# Altium project PCB_Project.PrjPcb
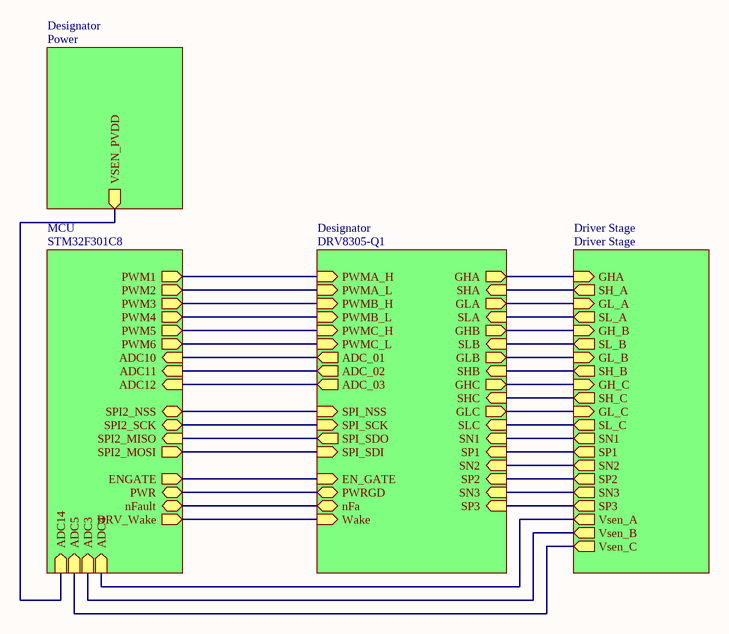
[diagram p0: Top.SchDoc]
5 sheets, 72 parts. Net scope: hierarchical (ports join the sheet entries above them; power ports are global).
Board files: 2layer.PcbDoc, 4_layer.PcbDoc
Sheets:
  Top.SchDoc
    MCU = STM32F301C8.SchDoc
    Designator = DRV8305-Q1.SchDoc
    Designator = Power.SchDoc
    Driver Stage = Driver Stage.SchDoc

## Sheet Top.SchDoc
size A4

### Sub-sheets
Designator = DRV8305-Q1: SPI_SCK (in), SPI_SDI (in), SPI_SDO (out), SPI_NSS (in), PWMA_H (in), PWMA_L (in), PWMB_H (in), PWMB_L (in), PWMC_H (in), PWMC_L (in), ADC_01 (out), ADC_02 (out), ADC_03 (out), nFa, EN_GATE (in), GHA (out), SHA (in), GLA (out), SLA (in), GHB (out), SLB (in), GLB (out), SHB (in), GHC (out), SHC (in), GLC (out), SLC (in), PWRGD (bidir), Wake (in), SN1 (in), SP1 (in), SN2 (in), SP2 (in), SN3 (in), SP3 (in)
Designator = Power: VSEN_PVDD (out)
Driver Stage = Driver Stage: GH_B (in), SH_B (out), GL_B (in), SL_B (out), GHA (in), SH_A (out), GL_A (in), SL_A (out), SL_C (out), GL_C (in), SH_C (out), GH_C (in), Vsen_C (out), Vsen_B (out), Vsen_A (out), SN1 (out), SP1 (out), SN2 (out), SP2 (out), SN3 (out), SP3 (out)
MCU = STM32F301C8: PWM1 (out), PWM2 (out), PWM3 (out), PWM4 (out), PWM5 (out), PWM6 (out), ADC10 (in), ADC11 (in), ADC12 (in), SPI2_NSS (bidir), SPI2_SCK (bidir), ADC4 (in), ADC3 (in), ADC5 (in), ADC14 (in), nFault (bidir), ENGATE (out), SPI2_MISO (in), SPI2_MOSI (out), PWR, DRV_Wake (out)

### Nets
MOT_A: sheet Designator/SHA, sheet Driver Stage/SH_A
MOT_B: sheet Designator/SHB, sheet Driver Stage/SH_B
MOT_C: sheet Designator/SHC, sheet Driver Stage/SH_C
VSEN_PVDD: sheet MCU/ADC14, sheet Designator/VSEN_PVDD
NetC30_1: sheet MCU/ADC4, sheet Driver Stage/Vsen_A
NetC31_1: sheet MCU/ADC3, sheet Driver Stage/Vsen_B
NetC32_1: sheet MCU/ADC5, sheet Driver Stage/Vsen_C
NetC33_1: sheet Designator/SN1, sheet Driver Stage/SN1
NetC33_2: sheet Designator/SP1, sheet Driver Stage/SP1
NetC34_1: sheet Designator/SN3, sheet Driver Stage/SN3
NetC34_2: sheet Designator/SP3, sheet Driver Stage/SP3
NetC35_1: sheet Designator/SN2, sheet Driver Stage/SN2
NetC35_2: sheet Designator/SP2, sheet Driver Stage/SP2
NetIC1_5: sheet MCU/SPI2_NSS, sheet Designator/SPI_NSS
NetIC1_6: sheet MCU/SPI2_SCK, sheet Designator/SPI_SCK
NetIC1_10: sheet MCU/PWM1, sheet Designator/PWMA_H
NetIC1_11: sheet MCU/PWM2, sheet Designator/PWMA_L
NetIC1_15: sheet MCU/ENGATE, sheet Designator/EN_GATE
NetIC1_16: sheet MCU/ADC10, sheet Designator/ADC_01
NetIC1_17: sheet MCU/nFault, sheet Designator/nFa
NetIC1_18: sheet MCU/ADC11, sheet Designator/ADC_02
NetIC1_19: sheet MCU/ADC12, sheet Designator/ADC_03
NetIC1_20: sheet MCU/PWR, sheet Designator/PWRGD
NetIC1_21: sheet MCU/PWM3, sheet Designator/PWMB_H
NetIC1_26: sheet MCU/DRV_Wake, sheet Designator/Wake
NetIC1_27: sheet MCU/SPI2_MISO, sheet Designator/SPI_SDO
NetIC1_28: sheet MCU/SPI2_MOSI, sheet Designator/SPI_SDI
NetIC1_29: sheet MCU/PWM5, sheet Designator/PWMC_H
NetIC1_30: sheet MCU/PWM6, sheet Designator/PWMC_L
NetIC1_31: sheet MCU/PWM4, sheet Designator/PWMB_L
NetNT1_2: sheet Designator/SLA, sheet Driver Stage/SL_A
NetNT2_2: sheet Designator/SLB, sheet Driver Stage/SL_B
NetNT3_2: sheet Designator/SLC, sheet Driver Stage/SL_C
NetQ2_4: sheet Designator/GHB, sheet Driver Stage/GH_B
NetQ3_4: sheet Designator/GHC, sheet Driver Stage/GH_C
NetQ4_4: sheet Designator/GLA, sheet Driver Stage/GL_A
NetQ5_4: sheet Designator/GLB, sheet Driver Stage/GL_B
NetQ6_4: sheet Designator/GLC, sheet Driver Stage/GL_C
NetU1_36: sheet Designator/GHA, sheet Driver Stage/GHA

## Sheet STM32F301C8.SchDoc: STM32F301C7
size A4; Revision: 1.0
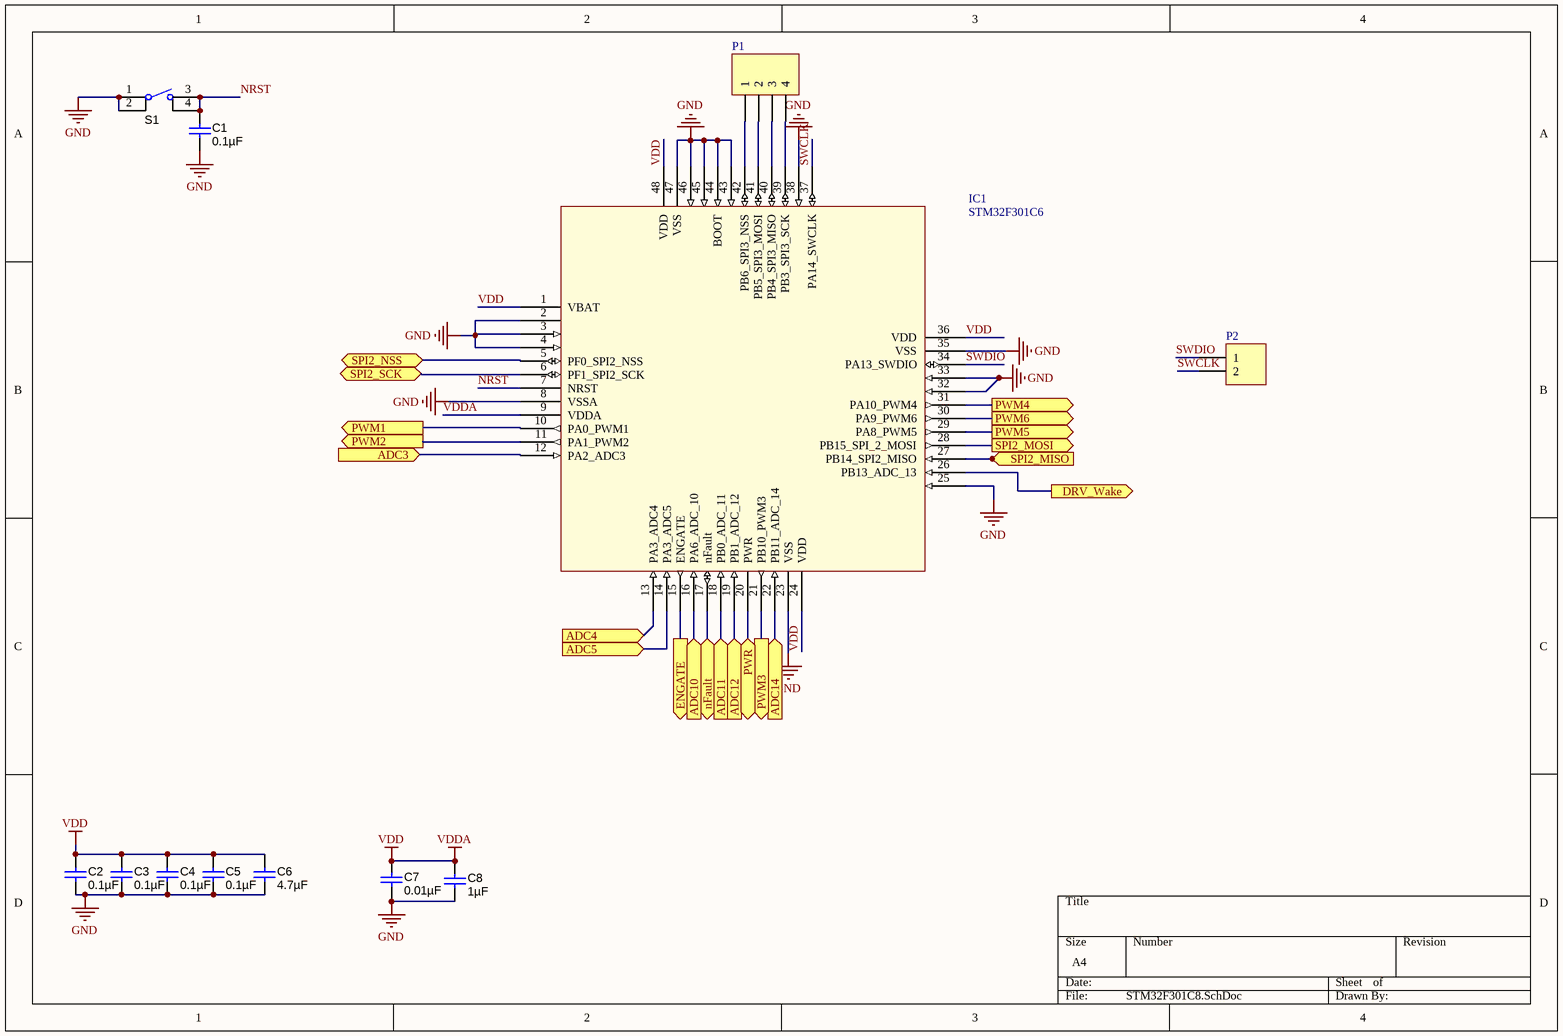
[diagram p1: STM32F301C8.SchDoc]

### Parts
C1  ValueDisplayed: 0.1µF  [0603L]  (hidden comment: C1608X7R1H104K)
C2  ValueDisplayed: 0.1µF  [0603L]  (hidden comment: C1608X7R1H104K)
C3  ValueDisplayed: 0.1µF  [0603L]  (hidden comment: C1608X7R1H104K)
C4  ValueDisplayed: 0.1µF  [0603L]  (hidden comment: C1608X7R1H104K)
C5  ValueDisplayed: 0.1µF  [0603L]  (hidden comment: C1608X7R1H104K)
C6  ValueDisplayed: 4.7µF  [0805L]  (hidden comment: GRM21BR71A475KA73L)
C7  ValueDisplayed: 0.01µF  [0603L]  (hidden comment: C1608X8R1H103K)
C8  ValueDisplayed: 1µF  [0603L]  (hidden comment: C1608X7R1C105K)
IC1  STM32F301C6  [LQFP48-7x7mm]
P1  (no value)  [HDR1X4]
P2  (no value)  [HDR1X2]
S1  4-1437565-1  [SW_FSM4JSMA]  (value not drawn)

### Ports
ADC3 (in), ADC4 (in), ADC5 (in), ADC10 (in), ADC11 (in), ADC12 (in), ADC14 (in), DRV_Wake (out), ENGATE (out), nFault (bidir), PWM1 (out), PWM2 (out), PWM3 (out), PWM4 (out), PWM5 (out), PWM6 (out), PWR, SPI2_MISO (in), SPI2_MOSI (out), SPI2_NSS (bidir), SPI2_SCK (bidir)

### Nets
GND: C1.2 C2.2 C3.2 C4.2 C5.2 C6.2 C7.2 C8.2 IC1.2 IC1.3 IC1.4 IC1.8(VSSA) IC1.23(VSS) IC1.25 IC1.32 IC1.33 IC1.35(VSS) IC1.38 IC1.43 IC1.44(BOOT) IC1.45 IC1.46 IC1.47(VSS) S1.1 S1.2
VDD: C2.1 C3.1 C4.1 C5.1 C6.1 C7.1 C8.1 IC1.1(VBAT) IC1.9(VDDA) IC1.24(VDD) IC1.36(VDD) IC1.48(VDD)  [also labelled VDDA]
NRST: C1.1 IC1.7(NRST) S1.3 S1.4
SWCLK: IC1.37(PA14_SWCLK) P2.2
SWDIO: IC1.34(PA13_SWDIO) P2.1
VSEN_PVDD: IC1.22(PB11_ADC_14) ; port ADC14
NetC30_1: IC1.13(PA3_ADC4) ; port ADC4
NetC31_1: IC1.12(PA2_ADC3) ; port ADC3
NetC32_1: IC1.14(PA3_ADC5) ; port ADC5
NetIC1_5: IC1.5(PF0_SPI2_NSS) ; port SPI2_NSS
NetIC1_6: IC1.6(PF1_SPI2_SCK) ; port SPI2_SCK
NetIC1_10: IC1.10(PA0_PWM1) ; port PWM1
NetIC1_11: IC1.11(PA1_PWM2) ; port PWM2
NetIC1_15: IC1.15(ENGATE) ; port ENGATE
NetIC1_16: IC1.16(PA6_ADC_10) ; port ADC10
NetIC1_17: IC1.17(nFault) ; port nFault
NetIC1_18: IC1.18(PB0_ADC_11) ; port ADC11
NetIC1_19: IC1.19(PB1_ADC_12) ; port ADC12
NetIC1_20: IC1.20(PWR) ; port PWR
NetIC1_21: IC1.21(PB10_PWM3) ; port PWM3
NetIC1_26: IC1.26(PB13_ADC_13) ; port DRV_Wake
NetIC1_27: IC1.27(PB14_SPI2_MISO) ; port SPI2_MISO
NetIC1_28: IC1.28(PB15_SPI_2_MOSI) ; port SPI2_MOSI
NetIC1_29: IC1.29(PA8_PWM5) ; port PWM5
NetIC1_30: IC1.30(PA9_PWM6) ; port PWM6
NetIC1_31: IC1.31(PA10_PWM4) ; port PWM4
NetIC1_39: IC1.39(PB3_SPI3_SCK) P1.4
NetIC1_40: IC1.40(PB4_SPI3_MISO) P1.3
NetIC1_41: IC1.41(PB5_SPI3_MOSI) P1.2
NetIC1_42: IC1.42(PB6_SPI3_NSS) P1.1

### Library data of the parts
C1-C5 = C1608X7R1H104K: CAP, CERM, 0.1 µF, 50 V, +/- 10%, X7R, 0603; Manufacturer: TDK; Polarized: N; CompType: Capacitor; Value: 0.1uF; U/M: EA; Cap_F: 0.0000001; Tolerance_%: 10; ESR_ohm: 0.017; Value1: 0.017 ohm; VDC_V: 50; Value2: 50V; TaMin_C: -55; TaMax_C: 125; Cap_Case: 0603; AEC Category: Q200; SymbolVersion: 2008-07-09; PartNumber: C1608X7R1H104K; PackageReference: 0603; RoHS: Y; MountType: SMT; Technology: Ceramic; TempCo: X7R; Published: 2008-06-19; Publisher: Texas Instruments; LatestRevisionDate: 2015-12-04; ComponentLink1Description: Datasheet link; ComponentLink1URL: http://www.tdk.co.jp/tefe02/e412_c.pdf; Supplier 1: Digi-Key; Supplier Part Number 1: 445-1314-1-ND; Supplier 2: Farnell; Supplier Part Number 2: 1118182; AEC Qualified: ?
C6 = GRM21BR71A475KA73L: CAP, CERM, 4.7 µF, 10 V, +/- 10%, X7R, 0805; Manufacturer: MuRata; Polarized: N; CompType: Capacitor; Value: 4.7uF; U/M: EA; Cap_F: 0.0000047; Tolerance_%: 10; Value1: Unknown; Value2: 10V; TaMin_C: -55; TaMax_C: 125; Cap_Case: 0805; AEC Category: Q200; SymbolVersion: 2008-07-09; PartNumber: GRM21BR71A475KA73L; PackageReference: 0805; RoHS: Y; VDC_V: 10; MountType: SMT; Technology: Ceramic; TempCo: X7R; Published: 2008-06-19; Publisher: Texas Instruments; LatestRevisionDate: 2015-12-04; ComponentLink1Description: Datasheet link; ComponentLink1URL: http://search.murata.co.jp/Ceramy/PnsearchViewAction.do?HnOFG=ON&HnNFG=ON&SEL_CNT=50&sLang=en&sKey=GRM21BR71A475KA73L&x=9&y=9&search=startwith; Supplier 1: Digi-Key; Supplier Part Number 1: GRM21BR71A475KA73L-ND; Supplier 2: Mouser; Supplier Part Number 2: 81-GRM21BR71A475KA73; Supplier 3: Farnell; Supplier Part Number 3: 1845769; AEC Qualified: ?
C7 = C1608X8R1H103K: CAP, CERM, 0.01 µF, 50 V, +/- 10%, X8R, 0603; Manufacturer: TDK; Polarized: N; CompType: Capacitor; Value: 0.01uF; U/M: EA; Cap_F: 0.00000001; Tolerance_%: 10; ESR_ohm: 0.051; Value1: 0.051 ohm; VDC_V: 50; Value2: 50V; TaMin_C: -55; TaMax_C: 150; Cap_Case: 0603; AEC Category: Q200; SymbolVersion: 2008-07-09; PartNumber: C1608X8R1H103K; PackageReference: 0603; RoHS: Y; MountType: SMT; Technology: Ceramic; TempCo: X8R; Published: 2008-06-19; Publisher: Texas Instruments; LatestRevisionDate: 2015-12-04; ComponentLink1Description: Datasheet link; ComponentLink1URL: http://www.tdk.com/pdf/X8R.pdf; Supplier 1: Digi-Key; Supplier Part Number 1: 445-2504-1-ND; Supplier 2: Farnell; Supplier Part Number 2: 1844454; AEC Qualified: ?
C8 = C1608X7R1C105K: CAP, CERM, 1 µF, 16 V, +/- 10%, X7R, 0603; Manufacturer: TDK; Polarized: N; CompType: Capacitor; Value: 1uF; U/M: EA; Cap_F: 0.000001; Tolerance_%: 10; ESR_ohm: 0.0057; Value1: 0.0057 ohm; VDC_V: 16; Value2: 16V; TaMin_C: -55; TaMax_C: 125; Cap_Case: 0603; AEC Category: Q200; SymbolVersion: 2008-07-09; PartNumber: C1608X7R1C105K; PackageReference: 0603; RoHS: Y; MountType: SMT; Technology: Ceramic; TempCo: X7R; Published: 2008-06-19; Publisher: Texas Instruments; LatestRevisionDate: 2015-12-04; ComponentLink1Description: Datasheet link; ComponentLink1URL: http://www.tdk.co.jp/tefe02/e412_c.pdf; Supplier 1: Digi-Key; Supplier Part Number 1: 445-1604-1-ND; Supplier 2: Farnell; Supplier Part Number 2: 1907343; AEC Qualified: ?
P1 = Header 4: Header, 4-Pin; LatestRevisionDate: 17-Jul-2002; LatestRevisionNote: Re-released for DXP Platform.; Publisher: Altium Limited
P2 = Header 2: Header, 2-Pin; LatestRevisionDate: 17-Jul-2002; LatestRevisionNote: Re-released for DXP Platform.; Publisher: Altium Limited
S1 = 4-1437565-1: Switch, Tactile, SPST-NO, 0.05A, 12V, SMT; Manufacturer: TE Connectivity; SymbolCreator: a0412235; VDC_V: 12; SwitchFunction: Off-Mom; PositionCount: 1; CurrentRating_mA: 50; SymbolVersion: 2013-06-27; PartNumber: 4-1437565-1; MountType: SMT; ComponentLink1Description: Datasheet URL; ComponentLink1URL: http://www.te.com/commerce/DocumentDelivery/DDEController?Action=showdoc&DocId=Customer+Drawing%7F2-1437565-7%7FU2%7Fpdf%7FEnglish%7FENG_CD_2-1437565-7_U2.pdf%7F4-1437565-1; RoHS: Y; Circuit: SPST-NO; Orientation: Top Actuated; CompType: Switch; PackageReference: SW, SPST 6x6 mm; Publisher: Texas Instruments; LatestRevisionDate: 2015-11-30; Supplier 1: Digi-Key; Supplier Part Number 1: 450-1129-ND; Supplier 2: Mouser; Supplier Part Number 2: 506-FSM4JSMA

## Sheet DRV8305-Q1.SchDoc
size A4
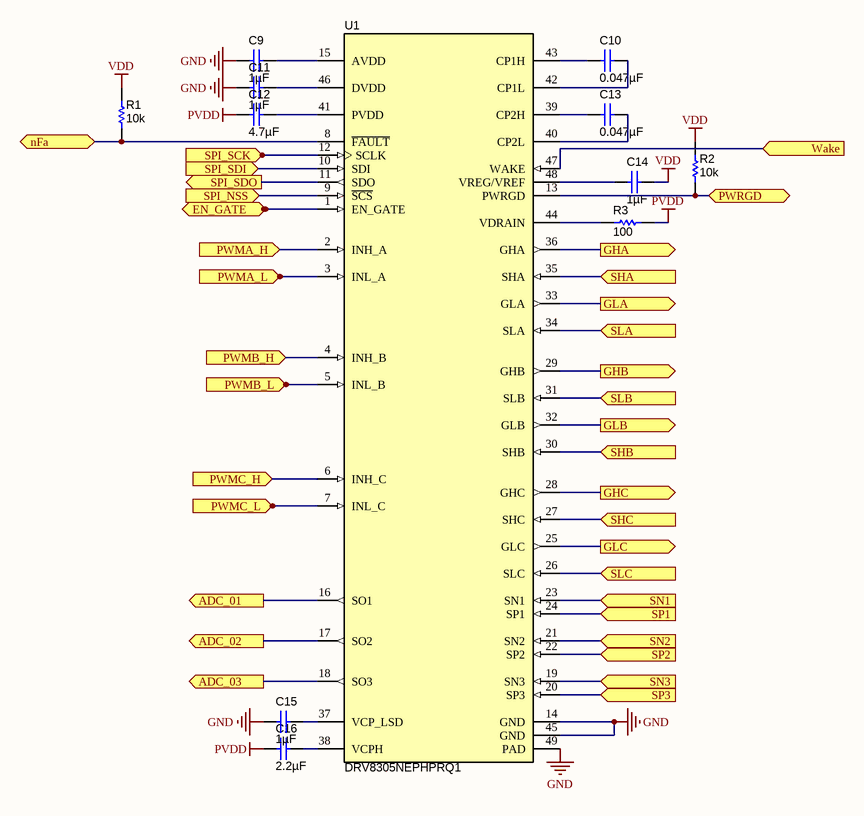
[diagram p2: DRV8305-Q1.SchDoc]

### Parts
C9  ValueDisplayed: 1µF  [0603L]  (hidden comment: C1608X7R1C105K)
C10  ValueDisplayed: 0.047µF  [0603L]  (hidden comment: C1608X7R1H473K)
C11  ValueDisplayed: 1µF  [0603L]  (hidden comment: C1608X7R1C105K)
C12  ValueDisplayed: 4.7µF  [0805L]  (hidden comment: GRM21BR71A475KA73L)
C13  ValueDisplayed: 0.047µF  [0603L]  (hidden comment: C1608X7R1H473K)
C14  ValueDisplayed: 1µF  [0603L]  (hidden comment: C1608X7R1C105K)
C15  ValueDisplayed: 1µF  [0603L]  (hidden comment: C1608X7R1C105K)
C16  ValueDisplayed: 2.2µF  [1210L]  (hidden comment: GRM32ER72A225KA35L)
R1  value 10k  [0603L]  (hidden comment: CRCW060310K0JNEA)
R2  value 10k  [0603L]  (hidden comment: CRCW060310K0JNEA)
R3  value 100  [0603L]  (hidden comment: CRCW0603100RJNEA)
U1  DRV8305NEPHPRQ1  [PHP0048G_N]

### Ports
ADC_01 (out), ADC_02 (out), ADC_03 (out), EN_GATE (in), GHA (out), GHB (out), GHC (out), GLA (out), GLB (out), GLC (out), nFa, PWMA_H (in), PWMA_L (in), PWMB_H (in), PWMB_L (in), PWMC_H (in), PWMC_L (in), PWRGD (bidir), SHA (in), SHB (in), SHC (in), SLA (in), SLB (in), SLC (in), SN1 (in), SN2 (in), SN3 (in), SP1 (in), SP2 (in), SP3 (in), SPI_NSS (in), SPI_SCK (in), SPI_SDI (in), SPI_SDO (out), Wake (in)

### Nets
GND: C9.2 C11.2 C15.2 U1.14(GND) U1.45(GND) U1.49(PAD)
PVDD: C12.2 C16.2 R3.2
VDD: C14.1 R1.2 R2.2
MOT_A: U1.35(SHA) ; port SHA
MOT_B: U1.30(SHB) ; port SHB
MOT_C: U1.27(SHC) ; port SHC
NetC9_1: C9.1 U1.15(AVDD)
NetC10_1: C10.1 U1.42(CP1L)
NetC10_2: C10.2 U1.43(CP1H)
NetC11_1: C11.1 U1.46(DVDD)
NetC12_1: C12.1 U1.41(PVDD)
NetC13_1: C13.1 U1.40(CP2L)
NetC13_2: C13.2 U1.39(CP2H)
NetC14_2: C14.2 U1.48(VREG/VREF)
NetC15_1: C15.1 U1.37(VCP_LSD)
NetC16_1: C16.1 U1.38(VCPH)
NetC33_1: U1.23(SN1) ; port SN1
NetC33_2: U1.24(SP1) ; port SP1
NetC34_1: U1.19(SN3) ; port SN3
NetC34_2: U1.20(SP3) ; port SP3
NetC35_1: U1.21(SN2) ; port SN2
NetC35_2: U1.22(SP2) ; port SP2
NetIC1_5: U1.9(~{SCS}) ; port SPI_NSS
NetIC1_6: U1.12(SCLK) ; port SPI_SCK
NetIC1_10: U1.2(INH_A) ; port PWMA_H
NetIC1_11: U1.3(INL_A) ; port PWMA_L
NetIC1_15: U1.1(EN_GATE) ; port EN_GATE
NetIC1_16: U1.16(SO1) ; port ADC_01
NetIC1_17: R1.1 U1.8(~{FAULT}) ; port nFa
NetIC1_18: U1.17(SO2) ; port ADC_02
NetIC1_19: U1.18(SO3) ; port ADC_03
NetIC1_20: R2.1 U1.13(PWRGD) ; port PWRGD
NetIC1_21: U1.4(INH_B) ; port PWMB_H
NetIC1_26: U1.47(WAKE) ; port Wake
NetIC1_27: U1.11(SDO) ; port SPI_SDO
NetIC1_28: U1.10(SDI) ; port SPI_SDI
NetIC1_29: U1.6(INH_C) ; port PWMC_H
NetIC1_30: U1.7(INL_C) ; port PWMC_L
NetIC1_31: U1.5(INL_B) ; port PWMB_L
NetNT1_2: U1.34(SLA) ; port SLA
NetNT2_2: U1.31(SLB) ; port SLB
NetNT3_2: U1.26(SLC) ; port SLC
NetQ2_4: U1.29(GHB) ; port GHB
NetQ3_4: U1.28(GHC) ; port GHC
NetQ4_4: U1.33(GLA) ; port GLA
NetQ5_4: U1.32(GLB) ; port GLB
NetQ6_4: U1.25(GLC) ; port GLC
NetR3_1: R3.1 U1.44(VDRAIN)
NetU1_36: U1.36(GHA) ; port GHA

### Library data of the parts
C9 C11 C14 C15 = C1608X7R1C105K: as C8 on sheet STM32F301C8; SymbolVersion: 2008-07-09; PartNumber: C1608X7R1C105K; PackageReference: 0603; RoHS: Y; MountType: SMT; Technology: Ceramic; TempCo: X7R; Published: 2008-06-19; Publisher: Texas Instruments; LatestRevisionDate: 2015-12-04; ComponentLink1Description: Datasheet link; ComponentLink1URL: http://www.tdk.co.jp/tefe02/e412_c.pdf; Supplier 1: Digi-Key; Supplier Part Number 1: 445-1604-1-ND; Supplier 2: Farnell; Supplier Part Number 2: 1907343; AEC Qualified: ?
C10 C13 = C1608X7R1H473K: CAP, CERM, 0.047 µF, 50 V, +/- 10%, X7R, 0603; Manufacturer: TDK; Polarized: N; CompType: Capacitor; Value: 0.047uF; U/M: EA; Cap_F: 0.000000047; Tolerance_%: 10; ESR_ohm: 0.0234; Value1: 0.0234 ohm; VDC_V: 50; Value2: 50V; TaMin_C: -55; TaMax_C: 125; Cap_Case: 0603; AEC Category: Q200; SymbolVersion: 2008-07-09; PartNumber: C1608X7R1H473K; PackageReference: 0603; RoHS: Y; MountType: SMT; Technology: Ceramic; TempCo: X7R; Published: 2008-06-19; Publisher: Texas Instruments; LatestRevisionDate: 2015-12-09; ComponentLink1Description: Datasheet link; ComponentLink1URL: http://www.tdk.co.jp/tefe02/e412_c.pdf; Supplier 1: Digi-Key; Supplier Part Number 1: 445-1313-1-ND; Supplier 2: Farnell; Supplier Part Number 2: 1907317; AEC Qualified: ?
C12 = GRM21BR71A475KA73L: as C6 on sheet STM32F301C8; SymbolVersion: 2008-07-09; PartNumber: GRM21BR71A475KA73L; PackageReference: 0805; RoHS: Y; VDC_V: 10; MountType: SMT; Technology: Ceramic; TempCo: X7R; Published: 2008-06-19; Publisher: Texas Instruments; LatestRevisionDate: 2015-12-04; ComponentLink1Description: Datasheet link; ComponentLink1URL: http://search.murata.co.jp/Ceramy/PnsearchViewAction.do?HnOFG=ON&HnNFG=ON&SEL_CNT=50&sLang=en&sKey=GRM21BR71A475KA73L&x=9&y=9&search=startwith; Supplier 1: Digi-Key; Supplier Part Number 1: GRM21BR71A475KA73L-ND; Supplier 2: Mouser; Supplier Part Number 2: 81-GRM21BR71A475KA73; Supplier 3: Farnell; Supplier Part Number 3: 1845769; AEC Qualified: ?
C16 = GRM32ER72A225KA35L: CAP, CERM, 2.2 µF, 100 V, +/- 10%, X7R, 1210; Manufacturer: MuRata; Polarized: N; CompType: Capacitor; Value: 2.2uF; U/M: EA; Cap_F: 0.0000022; Tolerance_%: 10; ESR_ohm: 0.007; Value1: 0.007 ohm; VDC_V: 100; Value2: 100V; IRMS_A: 4.4; TaMin_C: -55; TaMax_C: 125; Cap_Case: 1210; AEC Category: Q200; SymbolVersion: 2008-07-09; PartNumber: GRM32ER72A225KA35L; PackageReference: 1210; RoHS: Y; MountType: SMT; Technology: Ceramic; TempCo: X7R; Published: 2008-06-19; Publisher: Texas Instruments; LatestRevisionDate: 2015-12-04; ComponentLink1Description: Datasheet link; ComponentLink1URL: http://search.murata.co.jp/Ceramy/PnsearchViewAction.do?HnOFG=ON&HnNFG=ON&SEL_CNT=50&sLang=en&sKey=GRM32ER72A225KA35L&x=9&y=9&search=startwith; Supplier 1: Digi-Key; Supplier Part Number 1: 490-3385-1-ND; Supplier 2: Mouser; Supplier Part Number 2: 81-GRM32ER72A225KA35; Supplier 3: Farnell; Supplier Part Number 3: 1735547; AEC Qualified: ?
R1 R2 = CRCW060310K0JNEA: RES, 10 k, 5%, 0.1 W, 0603; Manufacturer: Vishay-Dale; CompType: Resistor; Res_ohm: 10000; Value_Code: 10k0; Tolerance_%: 5; Power_W: 0.1; Value2: 0.1W; VDC_V: 75; TempCo: 200 ppm/C; EIA_Code: E24; U/M: EA; AEC Category: Q200; SymbolVersion: 2009-05-29; PartNumber: CRCW060310K0JNEA; PackageReference: 0603; RoHS: Y; Value1: 5%; MountType: SMT; Technology: Thick Film; Published: 2008-06-26; Publisher: Texas Instruments; LatestRevisionDate: 2015-11-22; ComponentLink1Description: Datasheet link; ComponentLink1URL: http://www.vishay.com/docs/20035/dcrcwe3.pdf; Supplier 1: Digi-Key; Supplier Part Number 1: 541-10KGCT-ND; Supplier 2: Mouser; Supplier Part Number 2: 71-CRCW0603J-10K-E3; Supplier 3: Farnell; Supplier Part Number 3: 1469749; ValueDisplayed: 10k; AEC Qualified: ?
R3 = CRCW0603100RJNEA: RES, 100, 5%, 0.1 W, 0603; Manufacturer: Vishay-Dale; CompType: Resistor; Value_Code: 100R; Tolerance_%: 5; Power_W: 0.1; Value2: 0.1W; VDC_V: 75; TempCo: 200 ppm/C; EIA_Code: E24; U/M: EA; AEC Category: Q200; SymbolVersion: 2009-05-29; PartNumber: CRCW0603100RJNEA; PackageReference: 0603; RoHS: Y; Res_ohm: 100; Value1: 5%; MountType: SMT; Technology: Thick Film; Published: 2008-06-26; Publisher: Texas Instruments; LatestRevisionDate: 2015-11-22; ComponentLink1Description: Datasheet link; ComponentLink1URL: http://www.vishay.com/docs/20035/dcrcwe3.pdf; Supplier 1: Digi-Key; Supplier Part Number 1: 541-100GCT-ND; Supplier 2: Mouser; Supplier Part Number 2: 71-CRCW0603J-100-E3; Supplier 3: Farnell; Supplier Part Number 3: 1514715; ValueDisplayed: 100; AEC Qualified: ?
U1 = DRV83053EPHPRQ1: Three Phase Automotive Gate Driver with Three Integrated Current Shunt Amplifiers and Voltage Regulator, PHP0048G; Alternate PartNumber: DRV8305NEPHPQ1; Manufacturer: Texas Instruments; SymbolCreator: Altium; CompType: IC; U/M: EA; SymbolVersion: 2015-02-03; PartNumber: DRV8305NEPHPRQ1; PackageReference: PHP0048G; MountType: SMT; ComponentLink1Description: Datasheet Link; ComponentLink1URL: https://sps06.itg.ti.com/sites/KMS/crossdivteams/altium/docs/ComponentDatasheets/TI_Q100_3PhPredriver_DRV8305_v9.pdf; Publisher: Texas Instruments; LatestRevisionDate: 2015-12-21; Alternate Manufacturer: Texas Instruments

## Sheet Power.SchDoc
size A4
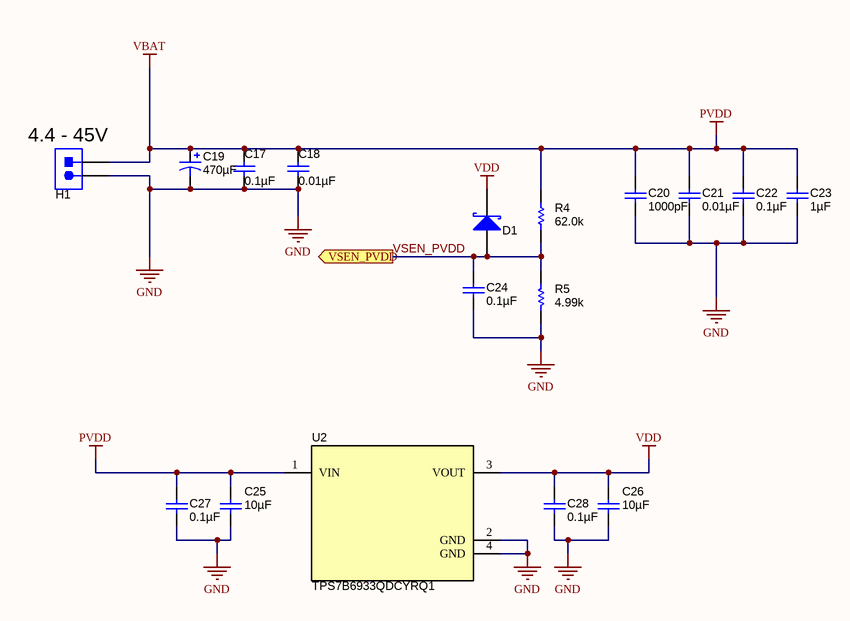
[diagram p3: Power.SchDoc]

### Parts
C17  ValueDisplayed: 0.1µF  [0603L]  (hidden comment: C1608X7R1H104K)
C18  ValueDisplayed: 0.01µF  [0603L]  (hidden comment: C1608X7R1H103K)
C19  ValueDisplayed: 470µF  [M_1000x2000]  (hidden comment: ECA-1HM471)
C20  ValueDisplayed: 1000pF  [0603L]  (hidden comment: C1608X7R1H102K)
C21  ValueDisplayed: 0.01µF  [0603L]  (hidden comment: C1608X7R1H103K)
C22  ValueDisplayed: 0.1µF  [0603L]  (hidden comment: C1608X7R1H104K)
C23  ValueDisplayed: 1µF  [0805L]  (hidden comment: GRM21BR71H105KA12L)
C24  ValueDisplayed: 0.1µF  [0603L]  (hidden comment: C0603C104J4RACTU)
C25  ValueDisplayed: 10µF  [1210L]  (hidden comment: GRM32ER71H106KA12L)
C26  ValueDisplayed: 10µF  [1210L]  (hidden comment: GRM32ER71H106KA12L)
C27  ValueDisplayed: 0.1µF  [0603L]  (hidden comment: C1608X7R1H104K)
C28  ValueDisplayed: 0.1µF  [0603L]  (hidden comment: C1608X7R1H104K)
D1  CD0603-B0130L  [Diode_0603]  (value not drawn)
H1  OSTT7022150  [TERM_BLK_OSTT7022150]  (value not drawn)
R4  value 62.0k  [0603L]  (hidden comment: RC0603FR-0762KL)
R5  value 4.99k  [0603L]  (hidden comment: CRCW06034K99FKEA)
U2  TPS7B6933QDCYRQ1  [DCY0004A_N]

### Ports
VSEN_PVDD (out)

### Nets
GND: C17.2 C18.2 C19.2(-) C20.2 C21.2 C22.2 C23.2 C24.2 C25.2 C26.2 C27.2 C28.2 H1.2 R5.1 U2.2(GND) U2.4(GND)
PVDD: C17.1 C18.1 C19.1(+) C20.1 C21.1 C22.1 C23.1 C25.1 C27.1 H1.1 R4.2 U2.1(VIN)  [also labelled VBAT]
VDD: C26.1 C28.1 D1.1(K) U2.3(VOUT)
VSEN_PVDD: C24.1 D1.2(A) R4.1 R5.2 ; port VSEN_PVDD

### Notes on the sheet
- (near H1) 4.4 - 45V

### Library data of the parts
C17 C22 C27 C28 = C1608X7R1H104K: as C1 on sheet STM32F301C8; SymbolVersion: 2008-07-09; PartNumber: C1608X7R1H104K; PackageReference: 0603; RoHS: Y; MountType: SMT; Technology: Ceramic; TempCo: X7R; Published: 2008-06-19; Publisher: Texas Instruments; LatestRevisionDate: 2015-12-04; ComponentLink1Description: Datasheet link; ComponentLink1URL: http://www.tdk.co.jp/tefe02/e412_c.pdf; Supplier 1: Digi-Key; Supplier Part Number 1: 445-1314-1-ND; Supplier 2: Farnell; Supplier Part Number 2: 1118182; AEC Qualified: ?
C18 C21 = C1608X7R1H103K: CAP, CERM, 0.01 µF, 50 V, +/- 10%, X7R, 0603; Manufacturer: TDK; Polarized: N; CompType: Capacitor; Value: 0.01uF; U/M: EA; Cap_F: 0.00000001; Tolerance_%: 10; ESR_ohm: 0.0539; Value1: 0.0539 ohm; VDC_V: 50; Value2: 50V; TaMin_C: -55; TaMax_C: 125; Cap_Case: 0603; AEC Category: Q200; SymbolVersion: 2008-07-09; PartNumber: C1608X7R1H103K; PackageReference: 0603; RoHS: Y; MountType: SMT; Technology: Ceramic; TempCo: X7R; Published: 2008-06-19; Publisher: Texas Instruments; LatestRevisionDate: 2015-12-04; ComponentLink1Description: Datasheet link; ComponentLink1URL: http://www.tdk.co.jp/tefe02/e412_c.pdf; Supplier 1: Digi-Key; Supplier Part Number 1: 445-1311-1-ND; Supplier 2: Farnell; Supplier Part Number 2: 1907315; AEC Qualified: ?
C19 = ECA-1HM471: CAP, AL, 470 µF, 50 V, +/- 20%, TH; Manufacturer: Panasonic; Polarized: Y; CompType: Capacitor; Value: 470uF; U/M: EA; Cap_F: 0.00047; Tolerance_%: 20; Value1: Unknown; VDC_V: 50; Value2: 50V; IRMS_A: 0.65; TaMin_C: -40; TaMax_C: 85; Cap_Case: 10x20mm; AEC Category: Q200; SymbolVersion: 2008-07-09; PartNumber: ECA-1HM471; PackageReference: 10x20; RoHS: Y; MountType: TH; Technology: AL; Series: M; Publisher: Texas Instruments; LatestRevisionDate: 2015-12-17; ComponentLink1Description: Datasheet link; ComponentLink1URL: http://industrial.panasonic.com/www-data/pdf/ABA0000/ABA0000CE12.pdf; Supplier 1: Digi-Key; Supplier Part Number 1: P5185-ND; Supplier 2: Mouser; Supplier Part Number 2: 667-ECA-1HM471; Supplier 3: Farnell; Supplier Part Number 3: 9693815; AEC Qualified: ?
C20 = C1608X7R1H102K: CAP, CERM, 1000 pF, 50 V, +/- 10%, X7R, 0603; Manufacturer: TDK; Polarized: N; CompType: Capacitor; Value: 1000pF; U/M: EA; Cap_F: 0.000000001; Tolerance_%: 10; ESR_ohm: 0.24; Value1: 0.24 ohm; VDC_V: 50; Value2: 50V; TaMin_C: -55; TaMax_C: 125; Cap_Case: 0603; AEC Category: Q200; SymbolVersion: 2008-07-09; PartNumber: C1608X7R1H102K; PackageReference: 0603; RoHS: Y; MountType: SMT; Technology: Ceramic; TempCo: X7R; Published: 2008-06-19; Publisher: Texas Instruments; LatestRevisionDate: 2015-12-04; ComponentLink1Description: Datasheet link; ComponentLink1URL: http://www.tdk.co.jp/tefe02/e412_c.pdf; Supplier 1: Digi-Key; Supplier Part Number 1: 445-1308-1-ND; Supplier 2: Farnell; Supplier Part Number 2: 1844239; AEC Qualified: ?
C23 = GRM21BR71H105KA12L: CAP, CERM, 1 µF, 50 V, +/- 10%, X7R, 0805; Manufacturer: MuRata; Polarized: N; CompType: Capacitor; Value: 1uF; U/M: EA; Cap_F: 0.000001; Tolerance_%: 10; Value1: Unknown; VDC_V: 50; Value2: 50V; TaMin_C: -55; TaMax_C: 125; Cap_Case: 0805; AEC Category: Q200; SymbolVersion: 2008-07-09; PartNumber: GRM21BR71H105KA12L; PackageReference: 0805; RoHS: Y; MountType: SMT; Technology: Ceramic; TempCo: X7R; Published: 2008-06-19; Publisher: Texas Instruments; LatestRevisionDate: 2015-12-04; ComponentLink1Description: Datasheet link; ComponentLink1URL: http://search.murata.co.jp/Ceramy/PnsearchViewAction.do?HnOFG=ON&HnNFG=ON&SEL_CNT=50&sLang=en&sKey=GRM21BR71H105KA12L&x=9&y=9&search=startwith; Supplier 1: Digi-Key; Supplier Part Number 1: 490-4736-1-ND; Supplier 2: Mouser; Supplier Part Number 2: 81-GRM21BR71H105KA2L; Supplier 3: Farnell; Supplier Part Number 3: 1735541; AEC Qualified: ?
C24 = C0603C104J4RACTU: CAP, CERM, 0.1 µF, 16 V, +/- 5%, X7R, 0603; Manufacturer: Kemet; Polarized: N; CompType: Capacitor; Value: 0.1uF; U/M: EA; Cap_F: 0.0000001; Tolerance_%: 5; Value1: Unknown; VDC_V: 16; Value2: 16V; TaMin_C: -55; TaMax_C: 125; Cap_Case: 0603; AEC Category: Q200; SymbolVersion: 2008-07-09; PartNumber: C0603C104J4RACTU; PackageReference: 0603; RoHS: Y; MountType: SMT; Technology: Ceramic; TempCo: X7R; Published: 2008-06-19; Publisher: Texas Instruments; LatestRevisionDate: 2015-12-04; ComponentLink1Description: Datasheet link; ComponentLink1URL: http://www.kemet.com/kemet/web/homepage/kechome.nsf/vapubfiles/F3102_Y5V.pdf/$file/F3102_Y5V.pdf; Supplier 1: Digi-Key; Supplier Part Number 1: 399-1097-1-ND; Supplier 2: Mouser; Supplier Part Number 2: 80-C0603C104J4R; Supplier 3: Farnell; Supplier Part Number 3: 1650834; AEC Qualified: ?
C25 C26 = GRM32ER71H106KA12L: CAP, CERM, 10 µF, 50 V, +/- 10%, X7R, 1210; Manufacturer: MuRata; Polarized: N; CompType: Capacitor; Value: 10uF; U/M: EA; Cap_F: 0.00001; Tolerance_%: 10; Value1: Unknown; VDC_V: 50; Value2: 50V; TaMin_C: -55; TaMax_C: 125; Cap_Case: 1210; AEC Category: Q200; SymbolVersion: 2008-07-09; PartNumber: GRM32ER71H106KA12L; PackageReference: 1210; RoHS: Y; MountType: SMT; Technology: Ceramic; TempCo: X7R; Published: 2008-06-19; Publisher: Texas Instruments; LatestRevisionDate: 2015-12-04; ComponentLink1Description: Datasheet link; ComponentLink1URL: http://www.murata.com/products/catalog/pdf/c02e.pdf; Supplier 1: Digi-Key; Supplier Part Number 1: 490-6544-1-ND; Supplier 2: Mouser; Supplier Part Number 2: 81-GRM32ER71H106KA2L; AEC Qualified: ?
D1 = CD0603-B0130L: Diode, Schottky, 35 V, 0.1 A, 0603 Diode; Manufacturer: Bourns; Value: 35V; U/M: EA; Vf_V: 0.44; Value1: 0.1A; Value2: 0.44V; Io_A: 0.1; Vr_V: 35; TJmax_C: 125; AEC Category: Q101; CompType: Diode; SymbolVersion: 2008-12-08; PartNumber: CD0603-B0130L; PackageReference: 0603 Diode; MountType: SMT; Type: Schottky; RoHS: Y; Published: 2008-06-26; Publisher: Texas Instruments; LatestRevisionDate: 2015-11-30; ComponentLink1Description: Datasheet link; ComponentLink1URL: http://www.bourns.com/pdfs/SBCD0603_1005.pdf; Supplier 1: Mouser; Supplier Part Number 1: 652-CD0603-B0130L; Supplier 2: Farnell; Supplier Part Number 2: 7599572; AEC Qualified: ?
H1 = OSTT7022150: Terminal Block, 30A, 9.52mm (.375) Pitch, 2-Pos, TH; Manufacturer: On-Shore Technology; SymbolCreator: a0412235; CompType: Connector; SymbolVersion: 2013-10-31; PartNumber: OSTT7022150; PackageReference: 19.62x21.5x12.5mm; RoHS: Y; MountType: TH; ComponentLink1Description: Datasheet URL; ComponentLink1URL: http://on-shore.com/sites/default/files/manuals/OSTT7XX2150.pdf; Publisher: Texas Instruments; LatestRevisionDate: 2015-12-23; Supplier 1: Digi-Key; Supplier Part Number 1: ED2677-ND
R4 = RC0603FR-0762KL: RES, 62.0 k, 1%, 0.1 W, 0603; Manufacturer: Yageo America; CompType: Resistor; Res_ohm: 62000; Value_Code: 62k0; Tolerance_%: 1; Power_W: 0.1; Value2: 0.1W; VDC_V: 150; TempCo: 200 ppm/C; U/M: EA; AEC Category: Q200; SymbolVersion: 2009-05-29; PartNumber: RC0603FR-0762KL; ValueDisplayed: 62.0k; PackageReference: 0603; RoHS: Y; Value1: 1%; MountType: SMT; Technology: Thick Film; Published: 2008-06-26; Publisher: Texas Instruments; LatestRevisionDate: 2015-11-22; ComponentLink1Description: Datasheet link; ComponentLink1URL: http://www.yageo.com/pdf/Pu-RC0603_51_PbFree_L_2.pdf; Supplier 1: Digi-Key; Supplier Part Number 1: 311-62.0KHRCT-ND; Supplier 2: Mouser; Supplier Part Number 2: 603-RC0603FR-0762KL; AEC Qualified: ?
R5 = CRCW06034K99FKEA: RES, 4.99 k, 1%, 0.1 W, 0603; Manufacturer: Vishay-Dale; CompType: Resistor; Res_ohm: 4990; Value_Code: 4k99; Tolerance_%: 1; Power_W: 0.1; Value2: 0.1W; VDC_V: 75; TempCo: 100 ppm/C; EIA_Code: E96; U/M: EA; AEC Category: Q200; SymbolVersion: 2009-05-29; PartNumber: CRCW06034K99FKEA; PackageReference: 0603; RoHS: Y; Value1: 1%; MountType: SMT; Technology: Thick Film; Published: 2008-06-26; Publisher: Texas Instruments; LatestRevisionDate: 2015-11-22; ComponentLink1Description: Datasheet link; ComponentLink1URL: http://www.vishay.com/docs/20035/dcrcwe3.pdf; Supplier 1: Digi-Key; Supplier Part Number 1: 541-4.99KHCT-ND; Supplier 2: Mouser; Supplier Part Number 2: 71-CRCW0603-4.99K-E3; Supplier 3: Farnell; Supplier Part Number 3: 1652885; ValueDisplayed: 4.99k; AEC Qualified: ?
U2 = TPS7B6933QDCYRQ1: High Voltage Ultra Low Iq - Low Drop Out Regulator, DCY0004A; Manufacturer: Texas Instruments; SymbolCreator: Altium; CompType: IC; U/M: EA; SymbolVersion: 2014-08-05; PartNumber: TPS7B6933QDCYRQ1; PackageReference: DCY0004A; MountType: SMT; ComponentLink1Description: Datasheet Link; ComponentLink1URL: http://www.ti.com/lit/ds/symlink/tps7b6933-q1.pdf; Publisher: Texas Instruments; LatestRevisionDate: 2015-12-29; Alternate Manufacturer: Texas Instruments

## Sheet Driver Stage.SchDoc
size A4
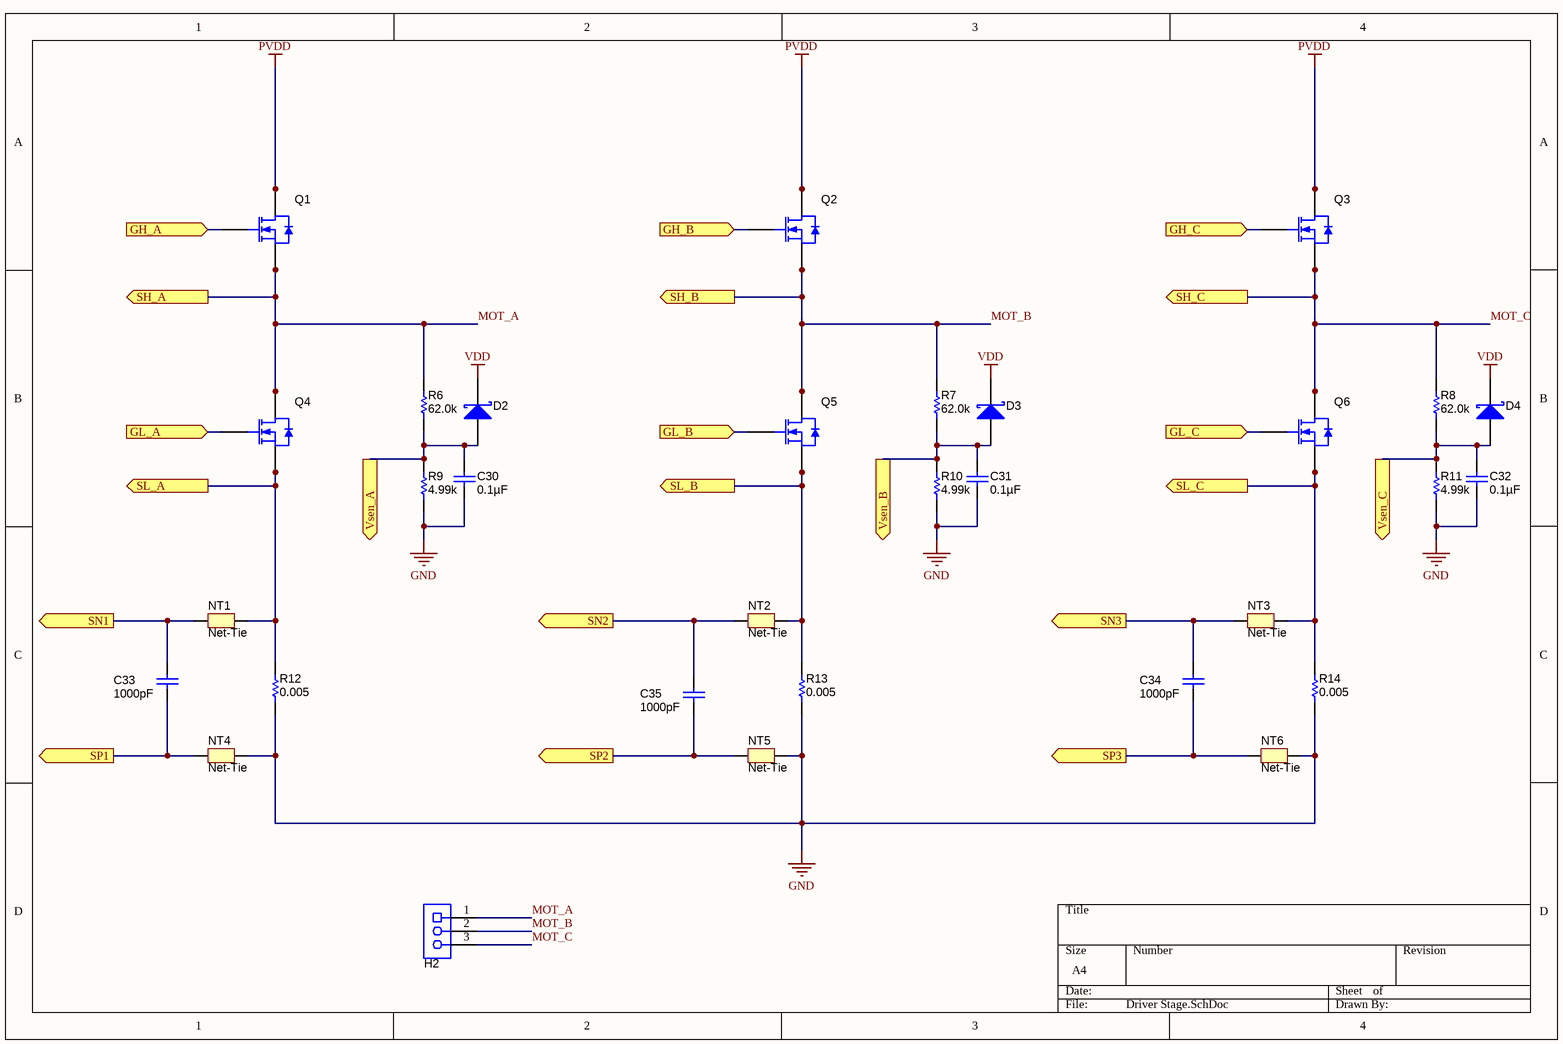
[diagram p4: Driver Stage.SchDoc]

### Parts
C30  ValueDisplayed: 0.1µF  [0603L]  (hidden comment: C0603C104J4RACTU)
C31  ValueDisplayed: 0.1µF  [0603L]  (hidden comment: C0603C104J4RACTU)
C32  ValueDisplayed: 0.1µF  [0603L]  (hidden comment: C0603C104J4RACTU)
C33  ValueDisplayed: 1000pF  [0603L]  (hidden comment: GRM188R71C102KA01D)
C34  ValueDisplayed: 1000pF  [0603L]  (hidden comment: GRM188R71C102KA01D)
C35  ValueDisplayed: 1000pF  [0603L]  (hidden comment: GRM188R71C102KA01D)
D2  CD0603-B0130L  [Diode_0603]  (value not drawn)
D3  CD0603-B0130L  [Diode_0603]  (value not drawn)
D4  CD0603-B0130L  [Diode_0603]  (value not drawn)
H2  OSTT7032150  [On-Shore_OSTT7032150]  (value not drawn)
NT1  Net-Tie  [Net-Tie_10mil]  (net tie, no BOM)
NT2  Net-Tie  [Net-Tie_10mil]  (net tie, no BOM)
NT3  Net-Tie  [Net-Tie_10mil]  (net tie, no BOM)
NT4  Net-Tie  [Net-Tie_10mil]  (net tie, no BOM)
NT5  Net-Tie  [Net-Tie_10mil]  (net tie, no BOM)
NT6  Net-Tie  [Net-Tie_10mil]  (net tie, no BOM)
Q1  CSD18540Q5B  [TRANS_NexFET_Q5B]  (value not drawn)
Q2  CSD18540Q5B  [TRANS_NexFET_Q5B]  (value not drawn)
Q3  CSD18540Q5B  [TRANS_NexFET_Q5B]  (value not drawn)
Q4  CSD18540Q5B  [TRANS_NexFET_Q5B]  (value not drawn)
Q5  CSD18540Q5B  [TRANS_NexFET_Q5B]  (value not drawn)
Q6  CSD18540Q5B  [TRANS_NexFET_Q5B]  (value not drawn)
R6  ValueDisplayed: 62.0k  [0603L]  (hidden comment: RC0603FR-0762KL)
R7  ValueDisplayed: 62.0k  [0603L]  (hidden comment: RC0603FR-0762KL)
R8  ValueDisplayed: 62.0k  [0603L]  (hidden comment: RC0603FR-0762KL)
R9  value 4.99k  [0603L]  (hidden comment: CRCW06034K99FKEA)
R10  value 4.99k  [0603L]  (hidden comment: CRCW06034K99FKEA)
R11  value 4.99k  [0603L]  (hidden comment: CRCW06034K99FKEA)
R12  ValueDisplayed: 0.005  [2512]  (hidden comment: LRMAP2512-R005FT4)
R13  ValueDisplayed: 0.005  [2512]  (hidden comment: LRMAP2512-R005FT4)
R14  ValueDisplayed: 0.005  [2512]  (hidden comment: LRMAP2512-R005FT4)

### Ports
GH_A (in), GH_B (in), GH_C (in), GL_A (in), GL_B (in), GL_C (in), SH_A (out), SH_B (out), SH_C (out), SL_A (out), SL_B (out), SL_C (out), SN1 (out), SN2 (out), SN3 (out), SP1 (out), SP2 (out), SP3 (out), Vsen_A (out), Vsen_B (out), Vsen_C (out)

### Nets
GND: C30.2 C31.2 C32.2 NT4.2 NT5.2 NT6.2 R9.1 R10.1 R11.1 R12.1 R13.1 R14.1
PVDD: Q1.5(D) Q1.6(D) Q1.7(D) Q1.8(D) Q2.5(D) Q2.6(D) Q2.7(D) Q2.8(D) Q3.5(D) Q3.6(D) Q3.7(D) Q3.8(D)
VDD: D2.1(K) D3.1(K) D4.1(K)
MOT_A: H2.1 Q1.1(S) Q1.2(S) Q1.3(S) Q4.5(D) Q4.6(D) Q4.7(D) Q4.8(D) R6.2 ; port SH_A
MOT_B: H2.2 Q2.1(S) Q2.2(S) Q2.3(S) Q5.5(D) Q5.6(D) Q5.7(D) Q5.8(D) R7.2 ; port SH_B
MOT_C: H2.3 Q3.1(S) Q3.2(S) Q3.3(S) Q6.5(D) Q6.6(D) Q6.7(D) Q6.8(D) R8.2 ; port SH_C
NetC30_1: C30.1 D2.2(A) R6.1 R9.2 ; port Vsen_A
NetC31_1: C31.1 D3.2(A) R7.1 R10.2 ; port Vsen_B
NetC32_1: C32.1 D4.2(A) R8.1 R11.2 ; port Vsen_C
NetC33_1: C33.1 NT1.1 ; port SN1
NetC33_2: C33.2 NT4.1 ; port SP1
NetC34_1: C34.1 NT3.1 ; port SN3
NetC34_2: C34.2 NT6.1 ; port SP3
NetC35_1: C35.1 NT2.1 ; port SN2
NetC35_2: C35.2 NT5.1 ; port SP2
NetNT1_2: NT1.2 Q4.1(S) Q4.2(S) Q4.3(S) R12.2 ; port SL_A
NetNT2_2: NT2.2 Q5.1(S) Q5.2(S) Q5.3(S) R13.2 ; port SL_B
NetNT3_2: NT3.2 Q6.1(S) Q6.2(S) Q6.3(S) R14.2 ; port SL_C
NetQ1_4: Q1.4(G) ; port GH_A
NetQ2_4: Q2.4(G) ; port GH_B
NetQ3_4: Q3.4(G) ; port GH_C
NetQ4_4: Q4.4(G) ; port GL_A
NetQ5_4: Q5.4(G) ; port GL_B
NetQ6_4: Q6.4(G) ; port GL_C

### Library data of the parts
C30-C32 = C0603C104J4RACTU: as C24 on sheet Power; SymbolVersion: 2008-07-09; PartNumber: C0603C104J4RACTU; PackageReference: 0603; RoHS: Y; MountType: SMT; Technology: Ceramic; TempCo: X7R; Published: 2008-06-19; Publisher: Texas Instruments; LatestRevisionDate: 2015-12-04; ComponentLink1Description: Datasheet link; ComponentLink1URL: http://www.kemet.com/kemet/web/homepage/kechome.nsf/vapubfiles/F3102_Y5V.pdf/$file/F3102_Y5V.pdf; Supplier 1: Digi-Key; Supplier Part Number 1: 399-1097-1-ND; Supplier 2: Mouser; Supplier Part Number 2: 80-C0603C104J4R; Supplier 3: Farnell; Supplier Part Number 3: 1650834; AEC Qualified: ?
C33-C35 = GRM188R71C102KA01D: CAP, CERM, 1000 pF, 16 V, +/- 10%, X7R, 0603; Manufacturer: MuRata; Polarized: N; CompType: Capacitor; Value: 1000pF; U/M: EA; Cap_F: 0.000000001; Tolerance_%: 10; Value1: Unknown; VDC_V: 16; Value2: 16V; TaMin_C: -55; TaMax_C: 125; Cap_Case: 0603; AEC Category: Q200; SymbolVersion: 2008-07-09; PartNumber: GRM188R71C102KA01D; PackageReference: 0603; RoHS: Y; MountType: SMT; Technology: Ceramic; TempCo: X7R; Published: 2008-06-19; Publisher: Texas Instruments; LatestRevisionDate: 2015-12-04; ComponentLink1Description: Datasheet link; ComponentLink1URL: http://search.murata.co.jp/Ceramy/PnsearchViewAction.do?HnOFG=ON&HnNFG=ON&SEL_CNT=50&sLang=en&sKey=GRM188R71C102KA01D&x=9&y=9&search=startwith; Supplier 1: Digi-Key; Supplier Part Number 1: GRM188R71C102KA01D-ND; Supplier 2: Mouser; Supplier Part Number 2: 81-GRM188R71C102KA1D; AEC Qualified: ?
D2-D4 = CD0603-B0130L: as D1 on sheet Power; CompType: Diode; SymbolVersion: 2008-12-08; PartNumber: CD0603-B0130L; PackageReference: 0603 Diode; MountType: SMT; Type: Schottky; RoHS: Y; Published: 2008-06-26; Publisher: Texas Instruments; LatestRevisionDate: 2015-11-30; ComponentLink1Description: Datasheet link; ComponentLink1URL: http://www.bourns.com/pdfs/SBCD0603_1005.pdf; Supplier 1: Mouser; Supplier Part Number 1: 652-CD0603-B0130L; Supplier 2: Farnell; Supplier Part Number 2: 7599572; AEC Qualified: ?
H2 = OSTT7032150: Terminal Block, 3x1, 9.52mm, TH; Manufacturer: On-Shore Technology; SymbolCreator: a0412235; Pitch_mm: 9.52; Gender: Female; Row_Count: 1; ContactFinish: Brass; SymbolVersion: 2013-10-03; PartNumber: OSTT7032150; PackageReference: Terminal Block, 3x1, 9.52mm, TH; CompType: Terminal Block; RoHS: Y; MountType: TH; ComponentLink1Description: Datasheet URL; ComponentLink1URL: http://www.on-shore.com/sites/default/files/manuals/OSTT7XX2150.pdf; Orientation: Vertical; PinCount: 3; Color: Green; Publisher: Texas Instruments; LatestRevisionDate: 2015-12-23; Supplier 1: Digi-Key; Supplier Part Number 1: ED2678-ND
NT1-NT6 = Net-Tie: Single point connection between nets.; SymbolCreator: codlsc; SymbolVersion: 2009-07-01; MountType: SMT; Publisher: Texas Instruments; LatestRevisionDate: 2015-10-18; LatestRevisionNote: Added Alternate PartNumber and Alternate Manufacturer parameters to appropriate components.; PackageReference: N/A
Q1-Q6 = CSD18540Q5B: MOSFET, N-CH, 60 V, 28 A, SON 5x6mm; Manufacturer: Texas Instruments; Alternate Manufacturer: None; U/M: EA; ChType: N; Value: 60V; VdsMax_V: 60; Value1: 0.0033 ohm; Rdson45_ohm: 0.0033; Value2: 41 nC; QgTyp_nC: 41; Vgs_V: 20; IdsMax_A: 28; AEC Category: Q101; SymbolVersion: 2008-07-09; CompType: MOSFET; PartNumber: CSD18540Q5B; PackageReference: SON 5x6mm; RoHS: Y; MountType: SMT; Published: 2008-06-19; Publisher: Texas Instruments; LatestRevisionDate: 2015-12-03; LatestRevisionNote: Added parts.; ComponentLink1Description: Datasheet link; ComponentLink1URL: http://www.ti.com/lit/ds/symlink/csd18540q5b.pdf; AEC Qualified: N
R6-R8 = RC0603FR-0762KL: RES, 62.0 k, 1%, 0.1 W, 0603; Manufacturer: Yageo America; CompType: Resistor; Value: 62.0k; Res_ohm: 62000; Value_Code: 62k0; Tolerance_%: 1; Power_W: 0.1; Value2: 0.1W; VDC_V: 150; TempCo: 200 ppm/C; U/M: EA; AEC Category: Q200; SymbolVersion: 2009-05-29; PartNumber: RC0603FR-0762KL; PackageReference: 0603; RoHS: Y; Value1: 1%; MountType: SMT; Technology: Thick Film; Published: 2008-06-26; Publisher: Texas Instruments; LatestRevisionDate: 2015-11-22; ComponentLink1Description: Datasheet link; ComponentLink1URL: http://www.yageo.com/pdf/Pu-RC0603_51_PbFree_L_2.pdf; Supplier 1: Digi-Key; Supplier Part Number 1: 311-62.0KHRCT-ND; Supplier 2: Mouser; Supplier Part Number 2: 603-RC0603FR-0762KL; AEC Qualified: ?
R9-R11 = CRCW06034K99FKEA: as R5 on sheet Power; SymbolVersion: 2009-05-29; PartNumber: CRCW06034K99FKEA; PackageReference: 0603; RoHS: Y; Value1: 1%; MountType: SMT; Technology: Thick Film; Published: 2008-06-26; Publisher: Texas Instruments; LatestRevisionDate: 2015-11-22; ComponentLink1Description: Datasheet link; ComponentLink1URL: http://www.vishay.com/docs/20035/dcrcwe3.pdf; Supplier 1: Digi-Key; Supplier Part Number 1: 541-4.99KHCT-ND; Supplier 2: Mouser; Supplier Part Number 2: 71-CRCW0603-4.99K-E3; Supplier 3: Farnell; Supplier Part Number 3: 1652885; ValueDisplayed: 4.99k; AEC Qualified: ?
R12-R14 = PMR100HZPFU5L00: RES SMD 0.005 OHM 1% 3W 2512; Manufacturer: TT Electronics/Welwyn; CompType: Resistor; Value: 0.005; Value_Code: 5L000; Tolerance_%: 1; Power_W: 3; TempCo: 100 ppm/C; U/M: EA; AEC Category: Q200; SymbolVersion: 2009-05-29; PartNumber: LRMAP2512-R005FT4; PackageReference: 2512; RoHS: Y; Res_ohm: 0.005; Value1: 1%; Value2: 3W; MountType: SMT; Technology: Thick Film; Published: 2008-06-26; Publisher: Texas Instruments; LatestRevisionDate: 2015-12-18; ComponentLink1Description: Datasheet link; ComponentLink1URL: http://www.digikey.com/product-detail/en/LRMAP2512-R005FT4/985-1558-1-ND/4021294; Supplier 1: Digi-Key; Supplier Part Number 1: 985-1558-1-ND; AEC Qualified: ?

## Nets that join several sheets
GND: STM32F301C8 (25 pins), DRV8305-Q1 (6 pins), Power (16 pins), Driver Stage (12 pins)
PVDD: DRV8305-Q1 (C12.2 C16.2 R3.2), Power (12 pins), Driver Stage (12 pins)
VDD: STM32F301C8 (12 pins), DRV8305-Q1 (C14.1 R1.2 R2.2), Power (C26.1 C28.1 D1.1 U2.3), Driver Stage (D2.1 D3.1 D4.1)
MOT_A: DRV8305-Q1 (U1.35), Driver Stage (9 pins)
MOT_B: DRV8305-Q1 (U1.30), Driver Stage (9 pins)
MOT_C: DRV8305-Q1 (U1.27), Driver Stage (9 pins)
NetC30_1: STM32F301C8 (IC1.13), Driver Stage (C30.1 D2.2 R6.1 R9.2)
NetC31_1: STM32F301C8 (IC1.12), Driver Stage (C31.1 D3.2 R7.1 R10.2)
NetC32_1: STM32F301C8 (IC1.14), Driver Stage (C32.1 D4.2 R8.1 R11.2)
NetC33_1: DRV8305-Q1 (U1.23), Driver Stage (C33.1 NT1.1)
NetC33_2: DRV8305-Q1 (U1.24), Driver Stage (C33.2 NT4.1)
NetC34_1: DRV8305-Q1 (U1.19), Driver Stage (C34.1 NT3.1)
NetC34_2: DRV8305-Q1 (U1.20), Driver Stage (C34.2 NT6.1)
NetC35_1: DRV8305-Q1 (U1.21), Driver Stage (C35.1 NT2.1)
NetC35_2: DRV8305-Q1 (U1.22), Driver Stage (C35.2 NT5.1)
NetIC1_5: STM32F301C8 (IC1.5), DRV8305-Q1 (U1.9)
NetIC1_6: STM32F301C8 (IC1.6), DRV8305-Q1 (U1.12)
NetIC1_10: STM32F301C8 (IC1.10), DRV8305-Q1 (U1.2)
NetIC1_11: STM32F301C8 (IC1.11), DRV8305-Q1 (U1.3)
NetIC1_15: STM32F301C8 (IC1.15), DRV8305-Q1 (U1.1)
NetIC1_16: STM32F301C8 (IC1.16), DRV8305-Q1 (U1.16)
NetIC1_17: STM32F301C8 (IC1.17), DRV8305-Q1 (R1.1 U1.8)
NetIC1_18: STM32F301C8 (IC1.18), DRV8305-Q1 (U1.17)
NetIC1_19: STM32F301C8 (IC1.19), DRV8305-Q1 (U1.18)
NetIC1_20: STM32F301C8 (IC1.20), DRV8305-Q1 (R2.1 U1.13)
NetIC1_21: STM32F301C8 (IC1.21), DRV8305-Q1 (U1.4)
NetIC1_26: STM32F301C8 (IC1.26), DRV8305-Q1 (U1.47)
NetIC1_27: STM32F301C8 (IC1.27), DRV8305-Q1 (U1.11)
NetIC1_28: STM32F301C8 (IC1.28), DRV8305-Q1 (U1.10)
NetIC1_29: STM32F301C8 (IC1.29), DRV8305-Q1 (U1.6)
NetIC1_30: STM32F301C8 (IC1.30), DRV8305-Q1 (U1.7)
NetIC1_31: STM32F301C8 (IC1.31), DRV8305-Q1 (U1.5)
NetNT1_2: DRV8305-Q1 (U1.34), Driver Stage (5 pins)
NetNT2_2: DRV8305-Q1 (U1.31), Driver Stage (5 pins)
NetNT3_2: DRV8305-Q1 (U1.26), Driver Stage (5 pins)
NetQ2_4: DRV8305-Q1 (U1.29), Driver Stage (Q2.4)
NetQ3_4: DRV8305-Q1 (U1.28), Driver Stage (Q3.4)
NetQ4_4: DRV8305-Q1 (U1.33), Driver Stage (Q4.4)
NetQ5_4: DRV8305-Q1 (U1.32), Driver Stage (Q5.4)
NetQ6_4: DRV8305-Q1 (U1.25), Driver Stage (Q6.4)
VSEN_PVDD: STM32F301C8 (IC1.22), Power (C24.1 D1.2 R4.1 R5.2)